# EAGLE design Torent_Module (EAGLE 9.6.1)
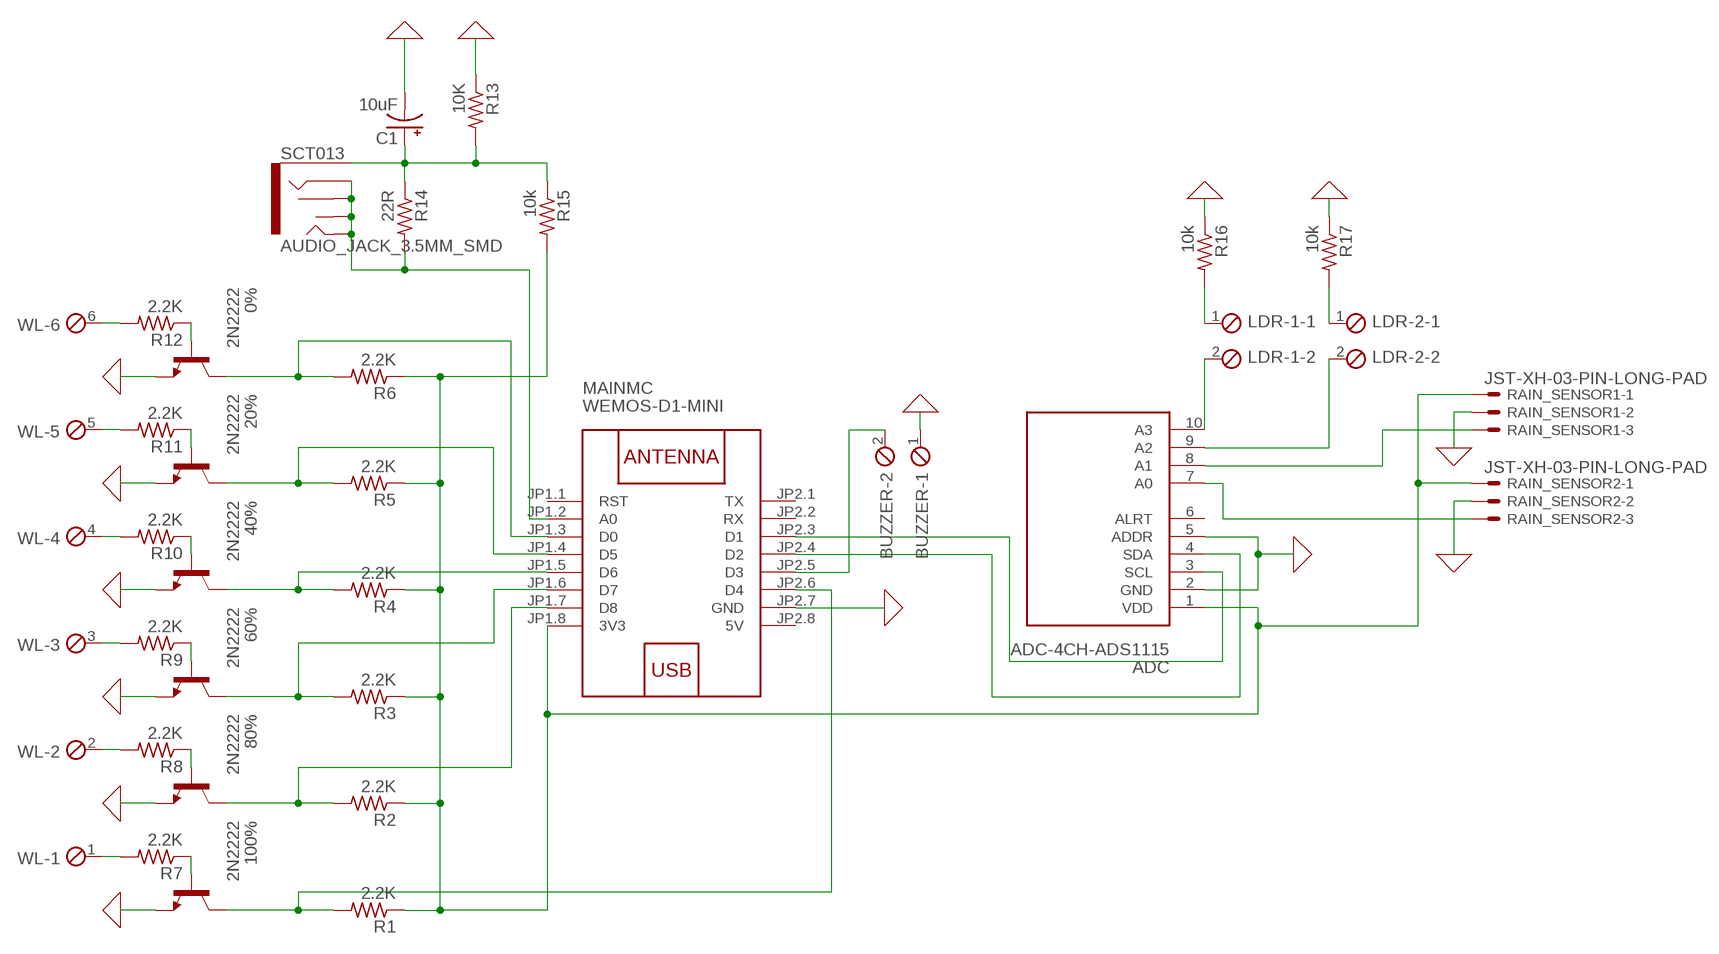
[diagram p0: schematic, sheet 1]

## Parts
0%  2N2222  [TO92-EBC-OVAL]
20%  2N2222  [TO92-EBC-OVAL]
40%  2N2222  [TO92-EBC-OVAL]
60%  2N2222  [TO92-EBC-OVAL]
80%  2N2222  [TO92-EBC-OVAL]
100%  2N2222  [TO92-EBC-OVAL]
ADC  ADC-4CH-ADS1115  [ADC-4CH-ADS1115]
BUZZER  MPT2  [2POL254]
C1  10uF  CPOL-USTT2D7  [TT2D7]
LDR-1  MPT2  [2POL254]
LDR-2  MPT2  [2POL254]
MAINMC  WEMOS-D1-MINI  [WEMOS-D1-MINI]
R1  2.2K  R-US_0207/9  [0207/9]
R2  2.2K  R-US_0207/9  [0207/9]
R3  2.2K  R-US_0207/9  [0207/9]
R4  2.2K  R-US_0207/9  [0207/9]
R5  2.2K  R-US_0207/9  [0207/9]
R6  2.2K  R-US_0207/9  [0207/9]
R7  2.2K  R-US_0207/9  [0207/9]
R8  2.2K  R-US_0207/9  [0207/9]
R9  2.2K  R-US_0207/9  [0207/9]
R10  2.2K  R-US_0207/9  [0207/9]
R11  2.2K  R-US_0207/9  [0207/9]
R12  2.2K  R-US_0207/9  [0207/9]
R13  10K  R-US_0207/9  [0207/9]
R14  22R  R-US_0207/9  [0207/9]
R15  10k  R-US_0207/9  [0207/9]
R16  10k  R-US_0207/9  [0207/9]
R17  10k  R-US_0207/9  [0207/9]
RAIN_SENSOR1  JST-XH-03-PIN-LONG-PAD  [JST-XH-03-PACKAGE-LONG-PAD]
RAIN_SENSOR2  JST-XH-03-PIN-LONG-PAD  [JST-XH-03-PACKAGE-LONG-PAD]
SCT013  AUDIO_JACK_3.5MM_SMD  [AUDIO-JACK-3.5MM-SMD]
WL  MPT6  [6POL254]

## Nets
0: 0%.E 20%.E 40%.E 60%.E 80%.E 100%.E ADC.2(GND) ADC.5(ADDR) BUZZER.1 C1.- MAINMC.JP2.7(GND) R13.1 R16.1 R17.1 RAIN_SENSOR1.2 RAIN_SENSOR2.2 ; supply symbol labelled GND
0%-1: 0%.B R12.1
0%-2: R12.2 WL.6
3.3V: ADC.1(VDD) MAINMC.JP1.8(3V3) R1.1 R2.1 R3.1 R4.1 R5.1 R6.1 R15.2 RAIN_SENSOR1.1 RAIN_SENSOR2.1
20%-1: 20%.B R11.1
20%-2: R11.2 WL.5
40%-1: 40%.B R10.1
40%-2: R10.2 WL.4
60%-1: 60%.B R9.1
60%-2: R9.2 WL.3
80%-1: 80%.B R8.1
80%-2: R8.2 WL.2
100%-1: 100%.B R7.1
100%-2: R7.2 WL.1
A0: MAINMC.JP1.2(A0) R14.2 SCT013.RING SCT013.RSH SCT013.TIP SCT013.TSH
ADSA2-0: ADC.9(A2) LDR-2.2
ADSA2-1: LDR-2.1 R17.2
ADSA3-0: ADC.10(A3) LDR-1.2
ADSA3-1: LDR-1.1 R16.2
D0: 0%.C MAINMC.JP1.3(D0) R6.2
D3: BUZZER.2 MAINMC.JP2.5(D3)
D4: 100%.C MAINMC.JP2.6(D4) R1.2
D5: 20%.C MAINMC.JP1.4(D5) R5.2
D6: 40%.C MAINMC.JP1.5(D6) R4.2
D7: 60%.C MAINMC.JP1.6(D7) R3.2
D8: 80%.C MAINMC.JP1.7(D8) R2.2
N$1: ADC.7(A0) RAIN_SENSOR2.3
N$2: ADC.8(A1) RAIN_SENSOR1.3
SCL: ADC.3(SCL) MAINMC.JP2.3(D1)
SDA: ADC.4(SDA) MAINMC.JP2.4(D2)
VCC_STC013: C1.+ R13.2 R14.1 R15.1 SCT013.SLEEVE
Unconnected: ADC.6(ALRT) MAINMC.JP1.1(RST) MAINMC.JP2.1(TX) MAINMC.JP2.2(RX)

## Power pins joined to a net without a drawn wire
5V: MAINMC.JP2.8(5V)

## Library data of the parts
0% 20% 40% 60% 80% 100% = adafruit:2N2222: NPN TRANSISTOR Big oval pads
ADC = diy-modules:ADC-4CH-ADS1115: 4 Channel 16-Bit Analog-to-Digital Converter based on ADS1115 chip Arduino ADS1115 Getting Started Tutorial is available here: http://henrysbench.capnfatz.com/henrys-bench/arduino-voltage-measurements/arduino-ads1115-module-getting-started-tutorial/ ADS1115 datasheet is available here: http://www.ti.com/lit/ds/symlink/ads1115.pdf Click here to find device on ebay.com <http://www.ebay.com/sch/ads1115+module>
BUZZER LDR-1 LDR-2 = con-phoenix-254:MPT2: PHOENIX CONNECTOR; OC_FARNELL: unknown; OC_NEWARK: unknown
C1 = rcl:CPOL-US: POLARIZED CAPACITOR, American symbol; SPICEPREFIX: C
MAINMC = diy-modules:WEMOS-D1-MINI: WEMOS D1 mini: Mini Wi-Fi Board based on ESP-8266 device More details can be found here: https://www.wemos.cc/product/d1-mini.html Click here to find device on ebay.com <http://www.ebay.com/sch/wemos+d1+mini+nodemcu>
R1-R17 = adafruit:R-US_: RESISTOR, American symbol
RAIN_SENSOR1 RAIN_SENSOR2 = Rembrandt:JST-XH-03-PIN: JST XH Connector 2 Pin Wire to board connector. Pitch: 2,54 mm, (0.100") Number of pins: 3 Created by Rembrandt Electronics www.rembrandtelectronics.com
SCT013 = SparkFun-Connectors:AUDIO_JACK_3.5MM: Audio Jack 3.5mm variants of PTH and SMT stereo audio jack with bypass switches. SparkFun Products: SparkFun SparkPunk Sound Kit <[https://www.sparkfun.com/products/11177]> - PTH MP3 Trigger <https://www.sparkfun.com/products/13720> -3.5mm SMD SparkFun PicoBoard <https://www.sparkfun.com/products/11888>- 2.5mm SMD; PROD_ID: CONN-10353
WL = con-phoenix-254:MPT6: PHOENIX CONNECTOR; OC_FARNELL: unknown; OC_NEWARK: unknown

## Board
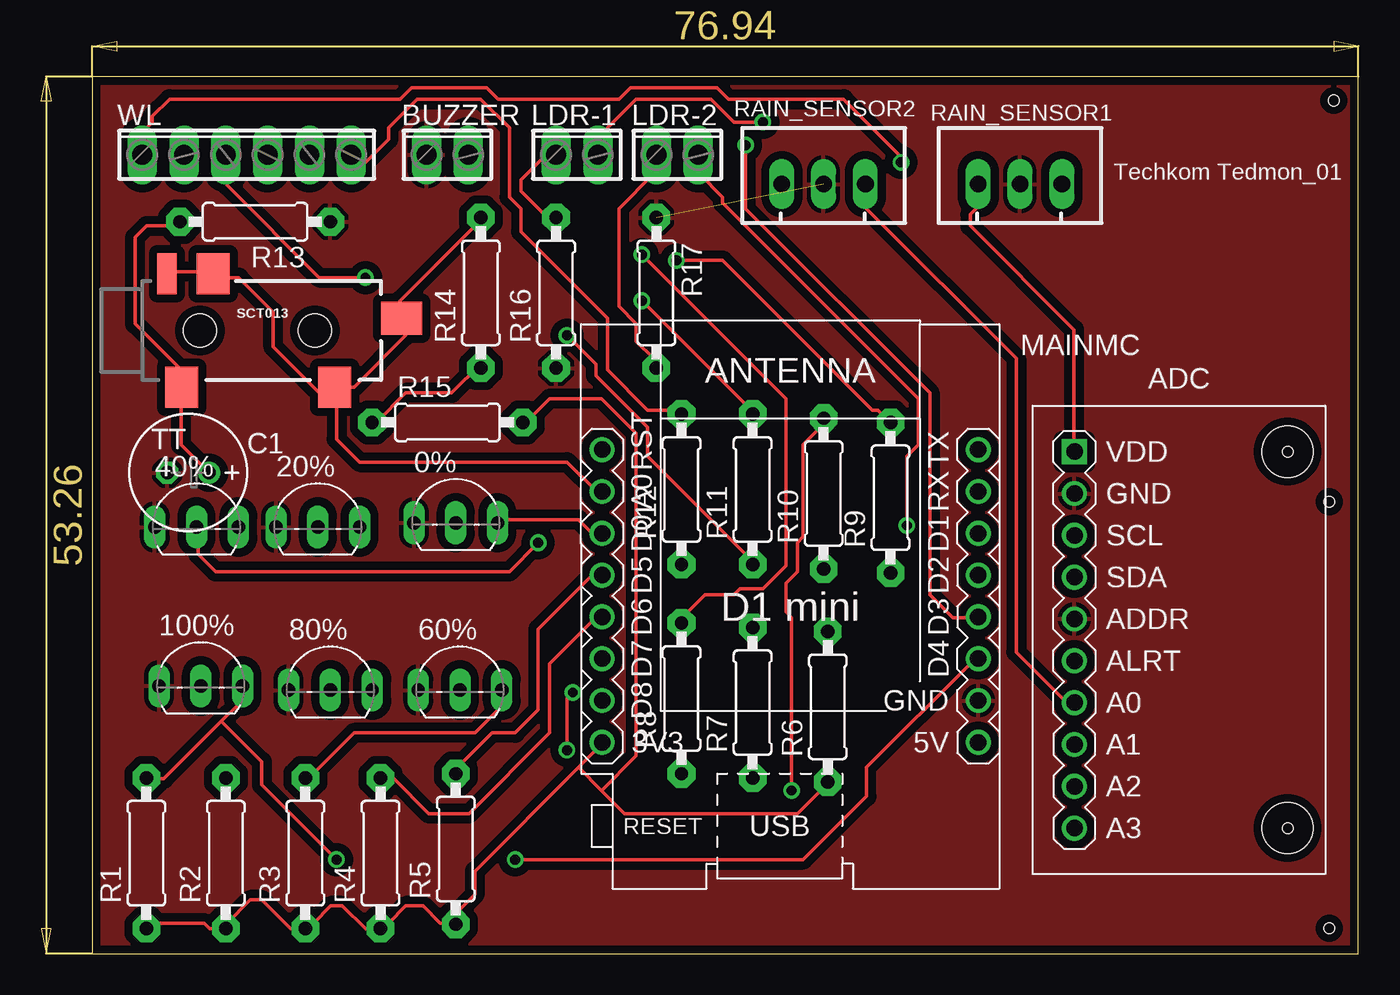
[diagram p1: board, top side]
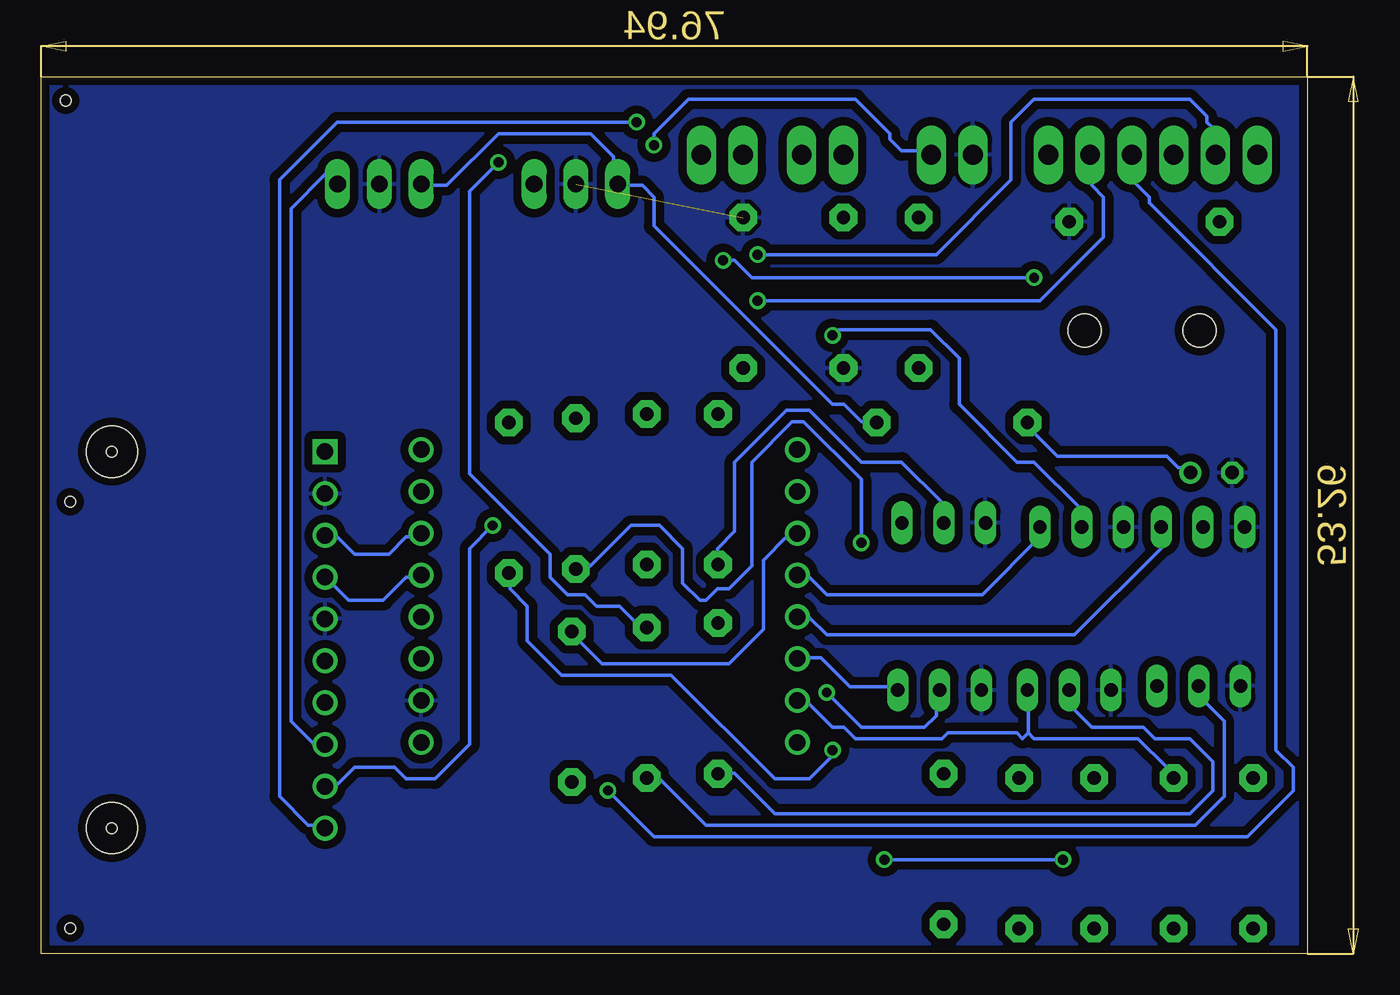
[diagram p2: board, bottom side, seen from below]

Size 76.94 x 53.26 mm. Coordinates in mm from the lower left corner, seen from the top.
Outline: 0,0 76.94,0 76.94,53.26 0,53.26 0,0
Copper layers (1*16): Top 0.035mm / dielectric 1.5mm / Bottom 0.035mm
Design rules "default *": minimum track width 0.2mm, minimum drill 0.6mm, track to track 0.5mm, track to pad 0.5mm, pad to pad 0.5mm, via to via 0.5mm, smd to smd 0.5mm, copper to edge 0.5mm, drill to drill 0.5mm, minimum pad ring 10mil, minimum via ring 8mil, stop-mask expansion 0.5mm, vias tented up to drill 0mil, thermal gap 10mil
Holes 0.64 mm at 72.64,30.48 72.64,7.62 75.44,51.82 75.18,1.52 75.18,27.43

### Footprints (pad centres in the part's own frame; a part is rotated, then mirrored left to right if it is on the bottom)
TO92-EBC-OVAL = drill 0.813 long: B 0,-1.27; C 2.54,-1.27; E -2.54,-1.27
ADC-4CH-ADS1115 = drill 1 square: 1 -6.35,11.43 | drill 1: 2 -6.35,8.89; 3 -6.35,6.35; 4 -6.35,3.81; 5 -6.35,1.27; 6 -6.35,-1.27; 7 -6.35,-3.81; 8 -6.35,-6.35; 9 -6.35,-8.89; 10 -6.35,-11.43 | hole 3.1: 6.604,11.43; 6.604,-11.43
2POL254 = drill 1.2 long: 1 -1.27,0; 2 1.27,0
TT2D7 = drill 0.813: + -1.27,0 | drill 0.813 octagon: - 1.27,0
WEMOS-D1-MINI = drill 1: JP1.1 -11.43,9.525; JP1.2 -11.43,6.985; JP1.3 -11.43,4.445; JP1.4 -11.43,1.905; JP1.5 -11.43,-0.635; JP1.6 -11.43,-3.175; JP1.7 -11.43,-5.715; JP1.8 -11.43,-8.255; JP2.1 11.43,9.525; JP2.2 11.43,6.985; JP2.3 11.43,4.445; JP2.4 11.43,1.905; JP2.5 11.43,-0.635; JP2.6 11.43,-3.175; JP2.7 11.43,-5.715; JP2.8 11.43,-8.255
0207/9 = drill 0.813 pad 1.676 octagon: 1 -4.572,0; 2 4.572,0
JST-XH-03-PACKAGE-LONG-PAD = drill 1.016 long: 1 -2.54,0; 2 0,0; 3 2.54,0
AUDIO-JACK-3.5MM-SMD = smd 2 x 2.5: RING 4.3,3.45; SLEEVE 2.4,-3.45; TIP 11.7,-3.45 | smd 1.2 x 2.5: RSH 1.5,3.45 | smd 2.5 x 2: TSH 15.75,0.75 | hole 2: 3.5,0; 10.5,0
6POL254 = drill 1.2 pad 1.778 long: 1 -6.35,0; 2 -3.81,0; 3 -1.27,0; 4 1.27,0; 5 3.81,0; 6 6.35,0

### Placement (x,y rotation side)
0%  22.1,27.43 0 top
20%  13.72,27.18 0 top
40%  6.35,27.18 0 top
60%  22.35,17.27 0 top
80%  14.48,17.27 0 top
100%  6.6,17.53 0 top
ADC  66.04,19.05 0 top
BUZZER  21.59,48.51 0 top
C1  5.84,29.21 180 top
LDR-1  29.46,48.51 0 top
LDR-2  35.56,48.51 0 top
MAINMC  42.42,21.08 0 top
R1  3.3,6.1 90 top
R2  8.13,6.1 90 top
R3  12.95,6.1 90 top
R4  17.53,6.1 90 top
R5  22.1,6.35 90 top
R6  44.7,14.99 90 top
R7  40.13,15.24 90 top
R8  35.81,15.49 90 top
R9  48.51,27.69 90 top
R10  44.45,27.94 90 top
R11  40.13,28.19 90 top
R12  35.81,28.19 90 top
R13  9.91,44.45 180 top
R14  23.62,40.13 90 top
R15  21.59,32.26 0 top
R16  28.19,40.13 90 top
R17  34.29,40.13 270 top
RAIN_SENSOR1  56.39,46.74 0 top
RAIN_SENSOR2  44.45,46.74 0 top
SCT013  3.05,37.85 0 top
WL  9.4,48.51 0 top

### Tracks (layer width: path | path; a pad name or v marks a point on that pad's centre or on a via)
0  (1 unrouted)
  pour Top: 76.96,0 76.96,53.34 0,53.34 0,0
  pour Bottom: 76.96,53.34 76.96,0 0,0 0,53.34
0%-1
  Bottom 0.2: 0%.B 22.21,26.35 22.21,27.4 24.66,29.85 27.11,29.85 30.26,33 31.66,33 34.81,29.85 34.81,25.65 35.86,24.6 35.86,23.9 R12.1
0%-2
  Top 0.2: R12.2 35.51,33 33.76,33 31.31,35.45 31.31,38.6 26.06,43.85 26.06,45.25 25.36,45.95 25.36,50.15 23.61,51.9 19.76,51.9 18.01,50.15 18.01,49.45 16.61,48.05 16.26,48.05 15.91,48.4 WL.6
3.3V
  Top 0.2: ADC.1 59.66,30.55 59.66,37.9 53.36,44.2 53.36,44.9 53.71,45.25 53.71,46.65 RAIN_SENSOR1.1 | R1.1 3.31,1.85 6.81,1.85 7.16,1.5 7.86,1.5 R2.1 8.21,1.85 9.61,3.25 10.31,3.25 12.06,1.5 12.76,1.5 R3.1 13.11,1.85 13.46,1.85 14.51,2.9 15.21,2.9 16.61,1.5 17.31,1.5 R4.1 17.66,1.85 18.01,1.85 19.06,2.9 20.11,2.9 21.16,1.85 21.86,1.85 R5.1 22.21,1.85 22.21,2.55 23.26,3.6 23.26,5 29.56,11.3 | 29.56,11.3 30.96,12.7 MAINMC.JP1.8 | 29.56,11.3 30.96,9.9 | 30.96,9.9 32.36,8.5 42.86,8.5 44.61,10.25 R6.1 | 30.96,9.9 33.06,12 33.06,31.6 30.96,33.7 27.81,33.7 26.41,32.3 R15.2
  Bottom 0.2: RAIN_SENSOR1.1 53.71,46.65 52.31,46.65 49.16,49.8 43.56,49.8 42.16,48.4 42.16,47 RAIN_SENSOR2.1 41.81,46.65 40.41,46.65 39.71,45.95 39.71,44.2 28.86,33.35 28.16,33.35 27.11,32.3 26.41,32.3 R15.2
20%-1  (via drill 0.6)
  Top 0.2: v28.86,37.55 30.61,35.8 30.61,35.1 33.76,31.95 33.76,30.2 39.71,24.25 40.06,24.25 40.41,23.9 R11.1
  Bottom 0.2: v28.86,37.55 28.51,37.9 22.91,37.9 21.16,36.15 21.16,33.35 17.66,29.85 16.61,29.85 13.81,27.05 13.81,26 20%.B
20%-2  (via drill 0.6)
  Top 0.2: v33.41,39.65 40.06,33 R11.2
  Bottom 0.2: v33.41,39.65 16.26,39.65 12.41,43.5 12.41,45.95 13.11,46.65 13.11,48.4 WL.5
40%-1  (via drill 0.6)
  Top 0.2: v27.11,24.95 25.36,23.2 7.51,23.2 6.46,24.25 6.46,25.65 40%.B
  Bottom 0.2: v27.11,24.95 27.11,28.8 30.61,32.3 31.31,32.3 33.76,29.85 33.76,23.55 35.16,22.15 35.86,22.15 36.56,21.45 36.91,21.45 37.96,22.5 37.96,24.6 39.36,26 41.11,26 43.56,23.55 44.26,23.55 R10.1
40%-2  (via drill 0.6)
  Top 0.2: v42.51,9.9 42.51,20.4 42.16,20.75 42.16,22.5 42.86,23.2 42.86,24.95 43.21,25.3 43.21,30.9 44.26,31.95 44.26,32.3 R10.2
  Bottom 0.2: v42.51,9.9 39.71,7.1 3.66,7.1 0.86,9.9 0.86,11.3 1.91,12.35 1.91,37.9 9.61,45.6 9.61,45.95 10.66,47 10.66,48.4 WL.4
60%-1  (via drill 0.6)
  Top 0.2: v29.21,15.85 28.86,15.5 v28.86,12.35
  Bottom 0.2: v29.21,15.85 27.11,13.75 23.26,13.75 22.56,14.45 22.56,15.85 60%.B | v28.86,12.35 28.86,12 30.26,10.6 32.36,10.6 38.66,16.9 45.31,16.9 47.41,19 47.41,21.1 48.46,22.15 48.46,22.85 R9.1
60%-2  (via drill 0.6)
  Top 0.2: v35.51,42.1 38.31,42.1 47.41,33 47.76,33 48.46,32.3 R9.2 | v16.61,41.05 13.81,41.05 8.21,46.65 8.21,48.4 WL.3
  Bottom 0.2: v35.51,42.1 34.81,42.1 33.76,41.05 v16.61,41.05
80%-1
  Bottom 0.2: 80%.B 14.16,15.85 14.16,14.8 13.11,13.75 9.96,13.75 9.26,13.05 7.16,13.05 5.76,11.65 5.76,9.9 7.16,8.5 32.36,8.5 34.81,10.95 35.51,10.95 R8.1
80%-2  (via drill 0.6)
  Top 0.2: v33.41,42.45 42.16,33.7 42.16,23.55 40.76,22.15 39.36,22.15 39.01,21.8 37.26,21.8 35.86,20.4 R8.2
  Bottom 0.2: v33.41,42.45 22.56,42.45 18.01,47 18.01,50.5 16.61,51.9 7.16,51.9 6.11,50.85 6.11,50.5 5.76,50.15 5.76,48.75 WL.2
100%-1
  Bottom 0.2: 100%.B 6.46,16.2 6.46,15.5 5.06,14.1 5.06,9.55 6.81,7.8 36.56,7.8 39.36,10.6 40.06,10.6 R7.1
100%-2  (via drill 0.6)
  Top 0.2: v49.16,48.05 49.16,48.4 45.66,51.9 38.66,51.9 37.96,52.6 32.71,52.6 32.01,51.9 24.66,51.9 23.96,52.6 19.41,52.6 18.71,51.9 4.71,51.9 3.66,50.85 3.66,50.5 3.31,50.15 3.31,48.75 WL.1
  Bottom 0.2: v49.16,48.05 50.91,46.3 50.91,29.15 46.01,24.25 46.01,22.85 44.96,21.8 43.91,21.8 43.21,21.1 41.81,21.1 40.76,20.05 40.41,20.05 R7.2
A0
  Top 0.2: SCT013.RSH 4.71,41.4 7.16,41.4 SCT013.RING 7.51,41.05 8.91,41.05 11.01,38.95 11.01,36.85 13.81,34.05 14.51,34.05 SCT013.TIP | SCT013.TIP 14.86,34.4 15.91,34.4 19.06,37.55 19.06,38.25 SCT013.TSH 18.71,38.6 18.71,39.65 23.61,44.55 R14.2 | MAINMC.JP1.2 30.96,28.1 30.61,28.1 28.86,29.85 16.26,29.85 14.86,31.25 14.86,34.05 SCT013.TIP
ADSA2-0  (via drill 0.6)
  Top 0.2: v49.51,26 49.51,30.2 50.21,30.9 50.21,33.7 38.31,45.6 38.31,45.95 36.91,47.35 36.91,48.4 LDR-2.2
  Bottom 0.2: v49.51,26 50.91,24.6 50.91,12.7 53.01,10.6 54.76,10.6 55.46,11.3 57.91,11.3 58.96,10.25 59.66,10.25 ADC.9
ADSA2-1
  Top 0.2: R17.2 34.11,35.8 34.11,36.15 33.06,37.2 33.06,38.25 32.01,39.3 32.01,45.25 34.11,47.35 34.11,48.4 LDR-2.1
ADSA3-0  (via drill 0.6)
  Top 0.2: v40.76,50.5 39.01,50.5 37.61,51.9 33.06,51.9 30.96,49.8 30.96,48.75 LDR-1.2
  Bottom 0.2: v40.76,50.5 58.96,50.5 62.46,47 62.46,9.55 60.71,7.8 60.01,7.8 ADC.10
ADSA3-1
  Top 0.2: R16.2 28.16,44.9 27.46,44.9 26.06,46.3 26.06,47 27.46,48.4 28.16,48.4 LDR-1.1
D0
  Top 0.2: 0%.C 24.66,26.35 29.56,26.35 30.26,25.65 30.96,25.65 MAINMC.JP1.3
  Bottom 0.2: R6.2 44.61,19.35 42.86,17.6 35.16,17.6 33.06,19.7 33.06,23.9 31.66,25.3 31.31,24.95 30.96,25.3 MAINMC.JP1.3
D3  (via drill 0.6)
  Top 0.2: v39.71,49.1 39.71,45.25 50.91,34.05 50.91,21.8 52.31,20.4 53.71,20.4 MAINMC.JP2.5
  Bottom 0.2: v39.71,49.1 39.71,49.8 37.61,51.9 27.46,51.9 25.36,49.8 25.36,49.45 24.66,48.75 22.91,48.75 BUZZER.2
D4  (via drill 0.6)
  Top 0.2: 7.86,14.1 4.36,10.6 3.31,10.6 R1.2 | 7.86,14.1 8.91,15.15 8.91,16.2 100%.C | v25.71,5.7 43.21,5.7 47.06,9.55 47.06,11.3 53.36,17.6 53.71,17.6 MAINMC.JP2.6 | v14.86,5.7 10.31,10.25 10.31,11.65 7.86,14.1
  Bottom 0.2: v14.86,5.7 v25.71,5.7
D5
  Top 0.2: R5.2 22.21,10.95 22.21,11.3 24.31,13.4 25.71,13.4 27.11,14.8 27.11,19.7 30.26,22.85 30.96,22.85 MAINMC.JP1.4
  Bottom 0.2: 20%.C 16.26,25.65 16.26,25.3 19.76,21.8 29.21,21.8 30.26,22.85 30.96,22.85 MAINMC.JP1.4
D6
  Top 0.2: R4.2 17.66,10.6 18.36,10.6 20.46,8.5 22.91,8.5 27.81,13.4 27.81,17.6 30.96,20.75 MAINMC.JP1.5
  Bottom 0.2: 40%.C 8.91,25.65 8.91,24.6 14.16,19.35 29.21,19.35 30.26,20.4 30.96,20.4 MAINMC.JP1.5
D7
  Top 0.2: R3.2 13.11,10.95 13.46,10.95 15.91,13.4 23.26,13.4 24.66,14.8 24.66,15.85 60%.C
  Bottom 0.2: 60%.C 25.01,16.2 27.81,16.2 29.56,17.95 30.96,17.95 MAINMC.JP1.6
D8
  Bottom 0.2: 16.96,13.4 16.96,15.85 80%.C | 16.96,13.4 16.61,13.05 10.31,13.05 8.56,11.3 8.21,11.3 7.86,10.95 R2.2 | 16.96,13.4 17.31,13.05 17.66,13.4 21.86,13.4 22.21,13.05 27.46,13.05 28.16,13.75 28.86,13.75 30.26,15.15 30.96,15.15 MAINMC.JP1.7
N$1
  Top 0.2: ADC.7 59.66,15.5 58.96,15.5 56.16,18.3 56.16,36.15 47.06,45.25 47.06,46.65 RAIN_SENSOR2.3
N$2
  Bottom 0.2: ADC.8 60.01,12.7 60.36,12.7 61.76,14.1 61.76,45.25 59.66,47.35 59.31,47.35 58.96,47 RAIN_SENSOR1.3
SCL
  Bottom 0.2: MAINMC.JP2.3 54.06,25.3 54.76,25.3 55.81,24.25 57.91,24.25 58.96,25.3 59.66,25.3 ADC.3
SDA
  Bottom 0.2: MAINMC.JP2.4 54.06,22.85 54.76,22.85 56.16,21.45 58.26,21.45 59.66,22.85 ADC.4
VCC_STC013
  Top 0.2: R15.1 17.31,32.3 19.06,34.05 21.86,34.05 23.61,35.8 R14.1 | C1.+ 6.81,29.5 5.41,30.9 5.41,34.05 SCT013.SLEEVE 5.41,34.4 5.41,35.45 2.61,38.25 2.61,43.5 3.31,44.2 5.06,44.2 R13.2
  Bottom 0.2: R15.1 16.96,31.95 15.21,30.2 8.56,30.2 7.86,29.5 7.16,29.5 C1.+

### Text on the board
tPlace: Techkom Tedmon_01